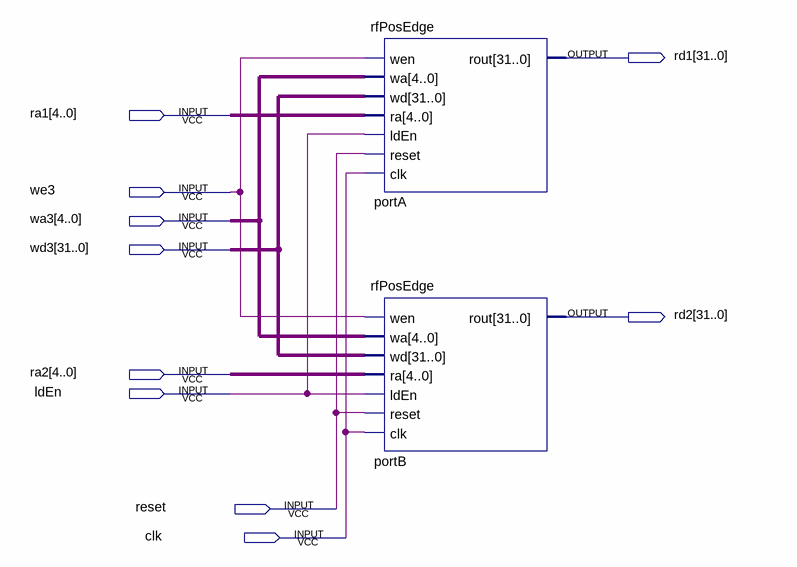
[diagram p0: schematic sheet]
// Quartus schematic syncRegFile.bdf as structural Verilog: 2 symbols, 10 pins
module syncRegFile (
  input  [4:0] ra1,
  input  we3,
  input  [4:0] wa3,
  input  [31:0] wd3,
  input  [4:0] ra2,
  input  ldEn,
  input  reset,
  input  clk,
  output [31:0] rd1,
  output [31:0] rd2
);

  rfPosEdge portA (.wen(we3), .wa(wa3), .wd(wd3), .ra(ra1), .ldEn(ldEn), .reset(reset), .clk(clk), .rout(rd1));
  rfPosEdge portB (.wen(we3), .wa(wa3), .wd(wd3), .ra(ra2), .ldEn(ldEn), .reset(reset), .clk(clk), .rout(rd2));
endmodule
